# EAGLE schematic Bottom PCB v36 (EAGLE 9.7.0)
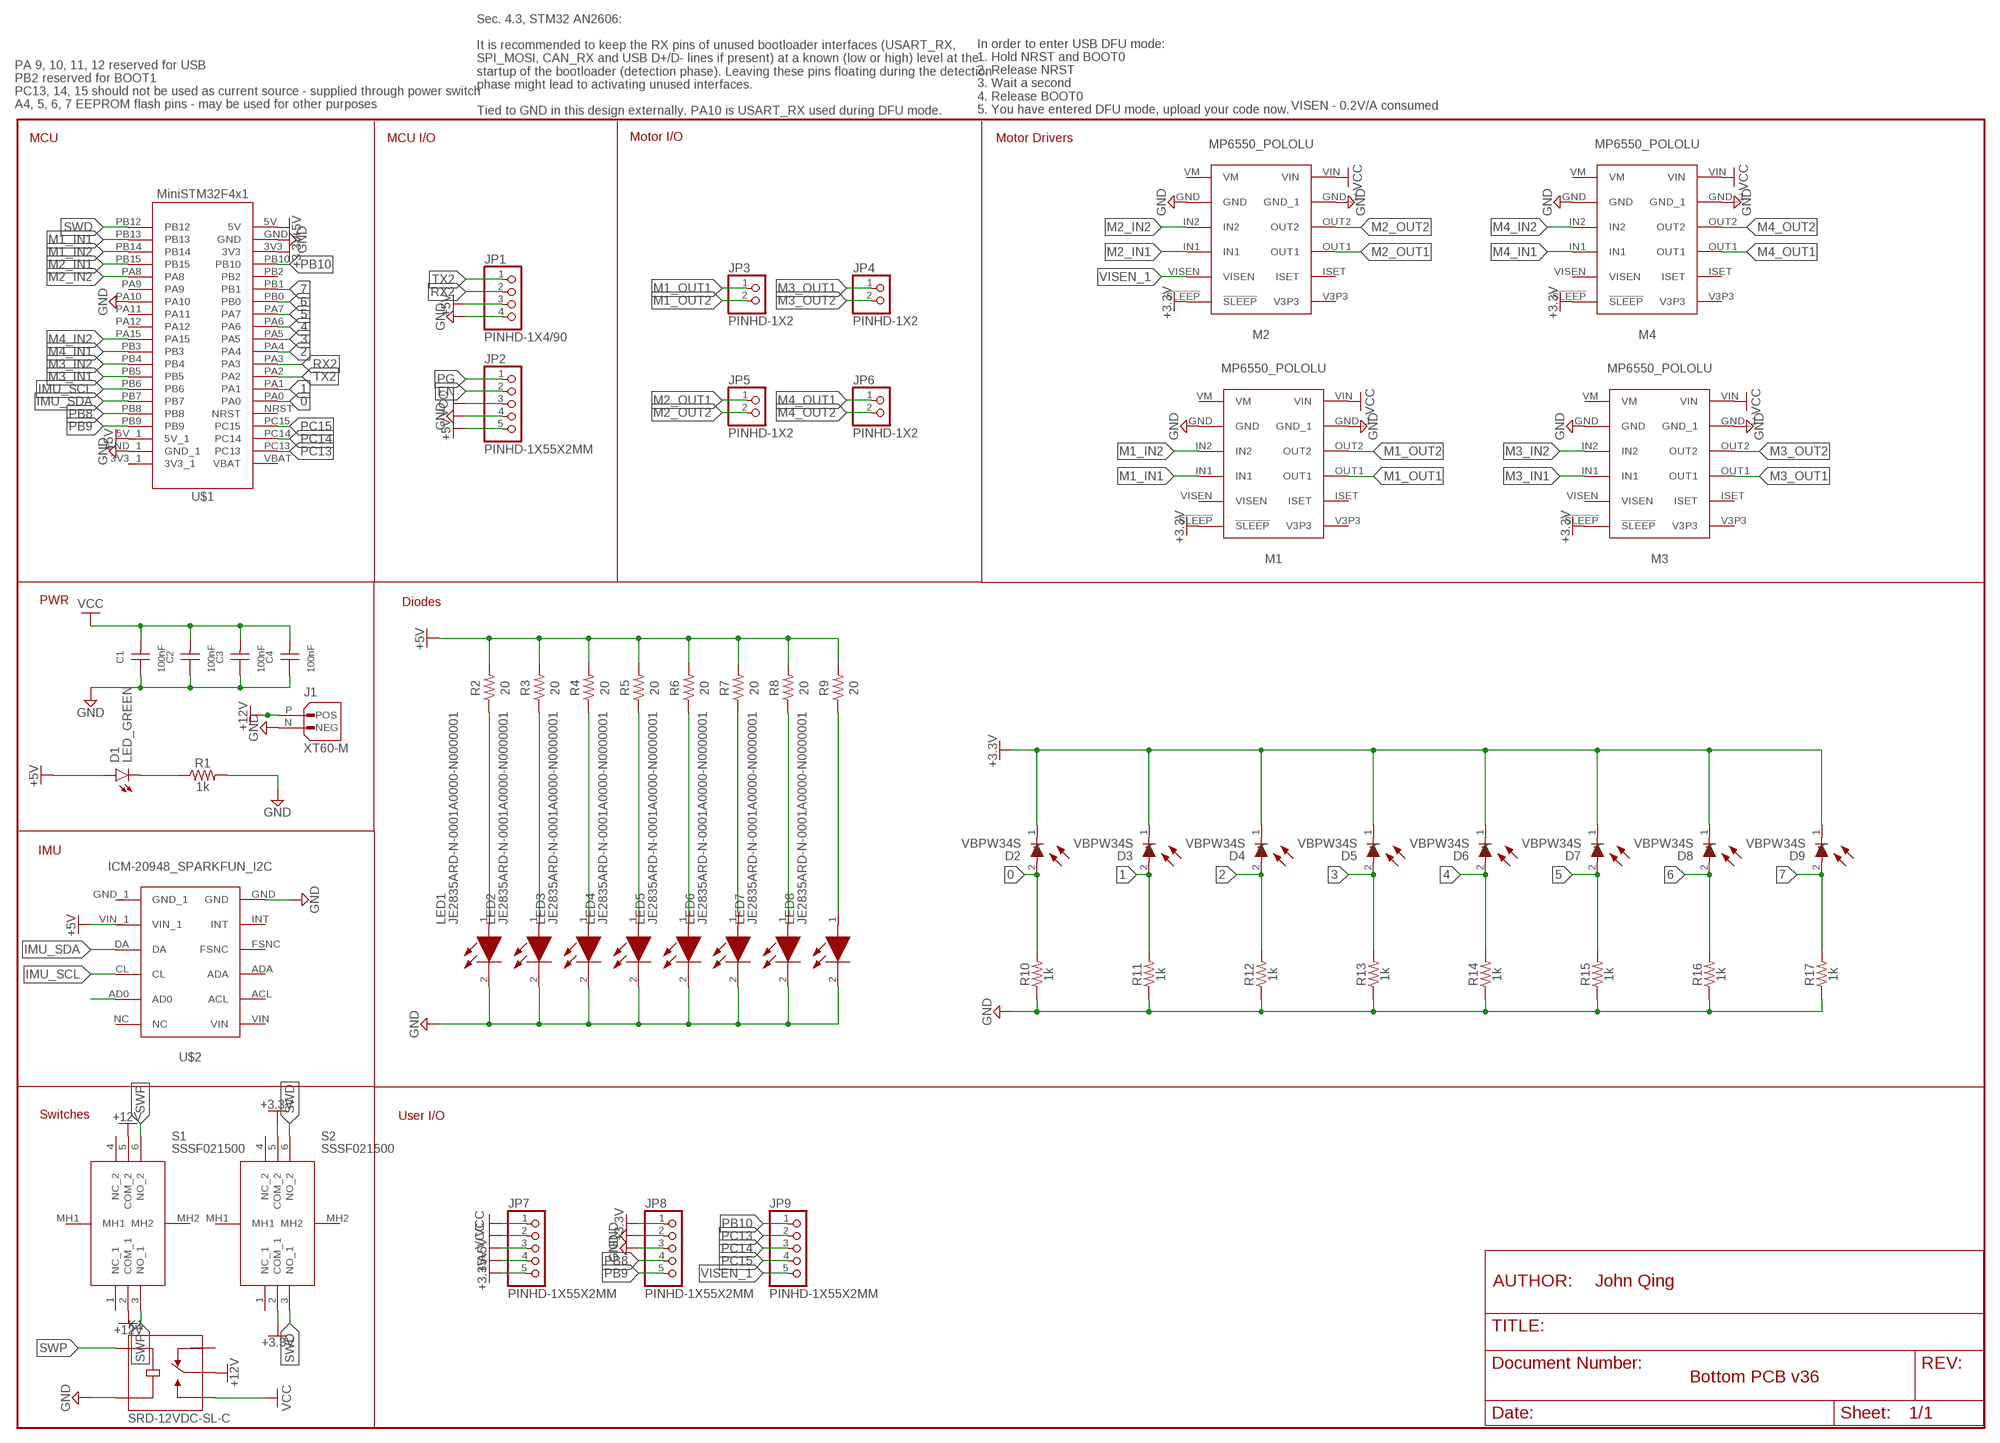
[diagram p0: schematic, sheet 1]

## Parts
C1  100nF  WCAP-CSGP_0603_885012206120_100V(DC)_W  [WCAP-CSGP_0603_W]
C2  100nF  WCAP-CSGP_0603_885012206120_100V(DC)_W  [WCAP-CSGP_0603_W]
C3  100nF  WCAP-CSGP_0603_885012206120_100V(DC)_W  [WCAP-CSGP_0603_W]
C4  100nF  WCAP-CSGP_0603_885012206120_100V(DC)_W  [WCAP-CSGP_0603_W]
D1  LED_GREEN  CHIP-FLAT-G_0402  [LEDC1005X25N_FLAT-G]
D2  VBPW34S  [VBPW34S]
D3  VBPW34S  [VBPW34S]
D4  VBPW34S  [VBPW34S]
D5  VBPW34S  [VBPW34S]
D6  VBPW34S  [VBPW34S]
D7  VBPW34S  [VBPW34S]
D8  VBPW34S  [VBPW34S]
D9  VBPW34S  [VBPW34S]
J1  XT60-M  [AMASS_XT60-M]
JP1  PINHD-1X4/90  [1X04/90]
JP2  PINHD-1X55X2MM  [1_05X2MM]
JP3  PINHD-1X2  [1X02]
JP4  PINHD-1X2  [1X02]
JP5  PINHD-1X2  [1X02]
JP6  PINHD-1X2  [1X02]
JP7  PINHD-1X55X2MM  [1_05X2MM]
JP8  PINHD-1X55X2MM  [1_05X2MM]
JP9  PINHD-1X55X2MM  [1_05X2MM]
K1  SRD-12VDC-SL-C  [RELAY_SRD-12VDC-SL-C]
LED1  JE2835ARD-N-0001A0000-N0000001  [JE2835ARDN0001A0000N0000001]
LED2  JE2835ARD-N-0001A0000-N0000001  [JE2835ARDN0001A0000N0000001]
LED3  JE2835ARD-N-0001A0000-N0000001  [JE2835ARDN0001A0000N0000001]
LED4  JE2835ARD-N-0001A0000-N0000001  [JE2835ARDN0001A0000N0000001]
LED5  JE2835ARD-N-0001A0000-N0000001  [JE2835ARDN0001A0000N0000001]
LED6  JE2835ARD-N-0001A0000-N0000001  [JE2835ARDN0001A0000N0000001]
LED7  JE2835ARD-N-0001A0000-N0000001  [JE2835ARDN0001A0000N0000001]
LED8  JE2835ARD-N-0001A0000-N0000001  [JE2835ARDN0001A0000N0000001]
M1  MP6550_POLOLU  [MP6550_POLOLU]
M2  MP6550_POLOLU  [MP6550_POLOLU]
M3  MP6550_POLOLU  [MP6550_POLOLU]
M4  MP6550_POLOLU  [MP6550_POLOLU]
R1  1k  1KOHM-0603-1/10W-1%  [0603]
R2  20  R-US_CHIP-1210(3225-METRIC)  [RESC3224X71]
R3  20  R-US_CHIP-1210(3225-METRIC)  [RESC3224X71]
R4  20  R-US_CHIP-1210(3225-METRIC)  [RESC3224X71]
R5  20  R-US_CHIP-1210(3225-METRIC)  [RESC3224X71]
R6  20  R-US_CHIP-1210(3225-METRIC)  [RESC3224X71]
R7  20  R-US_CHIP-1210(3225-METRIC)  [RESC3224X71]
R8  20  R-US_CHIP-1210(3225-METRIC)  [RESC3224X71]
R9  20  R-US_CHIP-1210(3225-METRIC)  [RESC3224X71]
R10  1k  1KOHM-0603-1/10W-1%  [0603]
R11  1k  1KOHM-0603-1/10W-1%  [0603]
R12  1k  1KOHM-0603-1/10W-1%  [0603]
R13  1k  1KOHM-0603-1/10W-1%  [0603]
R14  1k  1KOHM-0603-1/10W-1%  [0603]
R15  1k  1KOHM-0603-1/10W-1%  [0603]
R16  1k  1KOHM-0603-1/10W-1%  [0603]
R17  1k  1KOHM-0603-1/10W-1%  [0603]
S1  SSSF021500  [SSSF021500]
S2  SSSF021500  [SSSF021500]
U$1  MINISTM32F4X1  [MINISTM32F4X1]
U$2  ICM-20948_SPARKFUN_I2C  [ICM-20948_SPARKFUN_I2C]

## Nets
0: D2.2(A) R10.2 U$1.PA0
1: D3.2(A) R11.2 U$1.PA1
2: D4.2(A) R12.2 U$1.PA4
3: D5.2(A) R13.2 U$1.PA5
4: D6.2(A) R14.2 U$1.PA6
5: D7.2(A) R15.2 U$1.PA7
6: D8.2(A) R16.2 U$1.PB0
7: D9.2(A) R17.2 U$1.PB1
+3.3V: D2.1(K) D3.1(K) D4.1(K) D5.1(K) D6.1(K) D7.1(K) D8.1(K) D9.1(K) JP7.5 JP8.1 M1.!SLEEP M2.!SLEEP M3.!SLEEP M4.!SLEEP S2.2(COM_1) S2.5(COM_2) U$1.3V3
+5V: D1.A JP1.3 JP2.5 JP7.3 JP7.4 R2.2 R3.2 R4.2 R5.2 R6.2 R7.2 R8.2 R9.2 U$1.5V U$1.5V_1 U$2.VIN_1
+12V: J1.P(POS) K1.COM S1.2(COM_1) S1.5(COM_2)
EN: JP2.2
GND: C1.1 C2.1 C3.1 C4.1 J1.N(NEG) JP1.4 JP2.4 JP8.2 JP8.3 K1.COIL2 LED1.2(K) LED2.2(K) LED3.2(K) LED4.2(K) LED5.2(K) LED6.2(K) LED7.2(K) LED8.2(K) M1.GND M1.GND_1 M2.GND M2.GND_1 M3.GND M3.GND_1 M4.GND M4.GND_1 R1.2 R10.1 R11.1 R12.1 R13.1 R14.1 R15.1 R16.1 R17.1 U$1.GND U$1.GND_1 U$1.PA10 U$2.GND
IMU_SCL: U$1.PB6 U$2.CL
IMU_SDA: U$1.PB7 U$2.DA
M1_IN1: M1.IN1 U$1.PB13
M1_IN2: M1.IN2 U$1.PB14
M1_OUT1: JP3.1 M1.OUT1
M1_OUT2: JP3.2 M1.OUT2
M2_IN1: M2.IN1 U$1.PB15
M2_IN2: M2.IN2 U$1.PA8
M2_OUT1: JP5.1 M2.OUT1
M2_OUT2: JP5.2 M2.OUT2
M3_IN1: M3.IN1 U$1.PB5
M3_IN2: M3.IN2 U$1.PB4
M3_OUT1: JP4.1 M3.OUT1
M3_OUT2: JP4.2 M3.OUT2
M4_IN1: M4.IN1 U$1.PB3
M4_IN2: M4.IN2 U$1.PA15
M4_OUT1: JP6.1 M4.OUT1
M4_OUT2: JP6.2 M4.OUT2
N$1: D1.C R1.1
N$2: LED1.1(A) R2.1
N$3: LED2.1(A) R3.1
N$4: U$2.AD0
N$5: LED3.1(A) R4.1
N$6: LED4.1(A) R5.1
N$7: LED5.1(A) R6.1
N$8: LED6.1(A) R7.1
N$9: LED7.1(A) R8.1
N$10: LED8.1(A) R9.1
PB8: JP8.4 U$1.PB8
PB9: JP8.5 U$1.PB9
PB10: JP9.1 U$1.PB10
PC13: JP9.2 U$1.PC13
PC14: JP9.3 U$1.PC14
PC15: JP9.4 U$1.PC15
PG: JP2.1
RX2: JP1.2 U$1.PA3
SWD: S2.3(NO_1) S2.6(NO_2) U$1.PB12
SWP: K1.COIL1 S1.3(NO_1) S1.6(NO_2)
TX2: JP1.1 U$1.PA2
VCC: C1.2 C2.2 C3.2 C4.2 JP2.3 JP7.1 JP7.2 K1.NO M1.VIN M2.VIN M3.VIN M4.VIN
VISEN_1: JP9.5 M2.VISEN
Unconnected: K1.NC M1.ISET M1.V3P3 M1.VISEN M1.VM M2.ISET M2.V3P3 M2.VM M3.ISET M3.V3P3 M3.VISEN M3.VM M4.ISET M4.V3P3 M4.VISEN M4.VM S1.1(NC_1) S1.4(NC_2) S1.MH1 S1.MH2 S2.1(NC_1) S2.4(NC_2) S2.MH1 S2.MH2 U$1.3V3_1 U$1.NRST U$1.PA9 U$1.PA11 U$1.PA12 U$1.PB2 U$1.VBAT U$2.ACL U$2.ADA U$2.FSNC U$2.GND_1 U$2.INT U$2.NC U$2.VIN

## Notes on the sheet
- PA 9, 10, 11, 12 reserved for USB
  PB2 reserved for BOOT1
  PC13, 14, 15 should not be used as current source - supplied through power switch
  A4, 5, 6, 7 EEPROM flash pins - may be used for other purposes
- VISEN - 0.2V/A consumed
- In order to enter USB DFU mode:
  1. Hold NRST and BOOT0
  2. Release NRST
  3. Wait a second
  4. Release BOOT0
  5. You have entered DFU mode, upload your code now.
- Sec. 4.3, STM32 AN2606:
  
  It is recommended to keep the RX pins of unused bootloader interfaces (USART_RX,
  SPI_MOSI, CAN_RX and USB D+/D- lines if present) at a known (low or high) level at the
  startup of the bootloader (detection phase). Leaving these pins floating during the detection
  phase might lead to activating unused interfaces.
  
  Tied to GND in this design externally. PA10 is USART_RX used during DFU mode.
- MCU | MCU I/O | Motor I/O | Motor Drivers
- PWR
- Diodes
- IMU
- Switches | User I/O
- AUTHOR: | John Qing

## Library data of the parts
C1-C4 = Wurth_Capacitors_WCAP-CSGP:WCAP-CSGP_0603: WCAP-CSGP MLCCs 0603 General Purpose Characteristics General purpose product series High performance ceramic High electrical precision and stability ceramic especially for NP0 Minimal aging especially for NP0 Mounting style: SMT-Chip Ceramic: NP0 (Class I), X5R (Class II), X7R (Class II) Temperature coefficient: ±30 ppm/°C; ±0.54 % for NP0 ±15 % for X5R and X7R Operating temperature: -55 °C up to + 125 °C for NP0 and X7R -55 °C up to + 85 °C for X5R Termination: Cu/Ni/Sn Recommended soldering: Reflow soldering Wave soldering for size 0603 Wave soldering for size 0805 (only valid for the thickness ≤0.85 mm) Applications Temperature compensation (NP0) Coupling Decoupling Bypass Smoothing Filtering Resonant circuit <https://www.we-online.com/catalog/media/o177837v209%20MLCC_GRP_all.jpg> Details see: https://www.we-online.com/catalog/en/pbs/capacitors/multilayer_ceramic_chip_capacitors/mlcc_general_purpose Updated by Ella Wu 2022-06-20 2022(C) Würth Elektronik; CERAMIC-TYPE: X7R Class II; DATASHEET-URL: https://www.we-online.com/redexpert/spec/885012206120?ae; DF: 5%; HEIGHT: 0.8mm; MOUNT: SMT; OPERATING-TEMPERATURE: -55 up to +125 °C; PART-NUMBER: 885012206120; QMIN: -; RISO: 1GOhm; SIZE: 0603; TECHNICAL-REFERENCE: X7R0603104K100DFCT10000; VR: 100V(DC)
D1 = LED:CHIP-FLAT-G; CATEGORY: LED; COLOR: GREEN; DESCRIPTION: CHIP LED FLAT; SUB-CATEGORY: CHIP; TYPE: FLAT_TOP
D2-D9 = VBPW34S:VBPW34S: Photodiode PIN Chip 940nm 2-Pin SMD T/R Source: Datasheet <https://componentsearchengine.com/Datasheets/2/VBPW34S.pdf>; DESCRIPTION: Photodiode PIN Chip 940nm 2-Pin SMD T/R; HEIGHT: 1.4mm; MANUFACTURER_NAME: Vishay; MANUFACTURER_PART_NUMBER: VBPW34S; MOUSER_PART_NUMBER: 782-VBPW34S; MOUSER_PRICE-STOCK: https://www.mouser.co.uk/ProductDetail/Vishay-Semiconductors/VBPW34S?qs=Uj7aA%252BCqp8ZDwjFKEZ8K8A%3D%3D
J1 = XT60-M:XT60-M: Check availability <https://pricing.snapeda.com/parts/XT60-M/AMASS/view-part?ref=eda>; AVAILABILITY: Not in stock; CHECK_PRICES: https://www.snapeda.com/parts/XT60-M/AMASS/view-part/?ref=eda; DESCRIPTION: Plug; DC supply; XT60; male; PIN: 2; for cable; soldered; 30A; 500V; MF: AMASS; MP: XT60-M; PACKAGE: Package; PRICE: None; SNAPEDA_LINK: https://www.snapeda.com/parts/XT60-M/AMASS/view-part/?ref=snap
JP1 = Connector:PINHD-1X4: PIN HEADER; CATEGORY: Headers; DESCRIPTION: Header, Right Angle, 4 Position; MANUFACTURER: Generic; MPN: Generic; OPERATING_TEMPERATURE: Generic; PART_STATUS: Active; PITCH: 0.100" (2.54mm); ROHS_COMPLIANCE: Generic; SERIES: Generic; SUB-CATEGORY: Headers, Male Pins; TYPE: Board to Board or Cable, Unshrouded, Through Hole, Right Angle
JP2 JP7-JP9 = Connector:PINHD-1X5: PIN HEADER; CATEGORY: Headers; DESCRIPTION: Header, Straight, 5 Position; MANUFACTURER: Generic; MPN: Generic; OPERATING_TEMPERATURE: Generic; PART_STATUS: Active; PITCH: 0.079" (2.00mm); ROHS_COMPLIANCE: Generic; SERIES: Generic; SUB-CATEGORY: Headers, Male Pins; TYPE: Board to Board or Cable, Unshrouded, Through Hole, Straight
JP3-JP6 = Connector:PINHD-1X2: PIN HEADER; CATEGORY: Headers; DESCRIPTION: Header, Straight, 2 Position; MANUFACTURER: Generic; MPN: Generic; OPERATING_TEMPERATURE: Generic; PART_STATUS: Active; PITCH: 0.100" (2.54mm); ROHS_COMPLIANCE: Generic; SERIES: Generic; SUB-CATEGORY: Headers, Male Pins; TYPE: Board to Board or Cable, Unshrouded, Through Hole, Straight
K1 = SRD-12VDC-SL-C:SRD-12VDC-SL-C: General Purpose Non Latching 12VDC SPDT Through Hole Relays RoHS Check availability <https://pricing.snapeda.com/parts/SRD-12VDC-SL-C/Songle%20Relay/view-part?ref=eda>; AVAILABILITY: In Stock; CHECK_PRICES: https://www.snapeda.com/parts/SRD-12VDC-SL-C/Songle+Relay/view-part/?ref=eda; DESCRIPTION: General Purpose Non Latching 12VDC SPDT Through Hole Relays RoHS; MF: Songle Relay; MP: SRD-12VDC-SL-C; PACKAGE: NON STANDARD-5 Songle Relay; PRICE: None; SNAPEDA_LINK: https://www.snapeda.com/parts/SRD-12VDC-SL-C/Songle+Relay/view-part/?ref=snap
LED1-LED8 = JE2835ARD-N-0001A0000-N0000001:JE2835ARD-N-0001A0000-N0000001: LED Lighting Color J Red-Orange 615nm (610nm ~ 620nm) 1411 (3528 Metric) Source: Datasheet <https://cree-led.com/media/documents/JSeries-2835-Color_1.pdf>; DESCRIPTION: LED Lighting Color J Red-Orange 615nm (610nm ~ 620nm) 1411 (3528 Metric); HEIGHT: 0.8mm; MANUFACTURER_NAME: CREE LED; MANUFACTURER_PART_NUMBER: JE2835ARD-N-0001A0000-N0000001; MOUSER_PART_NUMBER: 941-JE2835ARDN01AN; MOUSER_PRICE-STOCK: https://www.mouser.co.uk/ProductDetail/Cree-LED/JE2835ARD-N-0001A0000-N0000001?qs=tlsG%2FOw5FFi%2FF9M49gTwyg%3D%3D
M1-M4 = MP6550_POLOLU:MP6550_POLOLU
R1 R10-R17 = SparkFun-Resistors:1KOHM: 1kΩ resistor A resistor is a passive two-terminal electrical component that implements electrical resistance as a circuit element. Resistors act to reduce current flow, and, at the same time, act to lower voltage levels within circuits. - Wikipedia; PROD_ID: RES-07856
R2-R9 = Resistor:R-US: Resistor Fixed - ANSI; CATEGORY: Resistor; SUB-CATEGORY: Fixed
S1 S2 = SSSF021500:SSSF021500: 8.5(H)mm, 2mm-travel Type Large-size general purpose Type Source: Datasheet <https://componentsearchengine.com/Datasheets/1/SSSF021500.pdf>; DESCRIPTION: 8.5(H)mm, 2mm-travel Type Large-size general purpose Type; HEIGHT: 14.5mm; MANUFACTURER_NAME: ALPS Electric; MANUFACTURER_PART_NUMBER: SSSF021500; MOUSER_PART_NUMBER: 688-SSSF021500; MOUSER_PRICE-STOCK: https://www.mouser.co.uk/ProductDetail/Alps-Alpine/SSSF021500?qs=fMKjfF2mFoj202onwSDRyQ%3D%3D
U$1 = MiniSTM32F4x1:MINISTM32F4X1
U$2 = ICM-20948_SPARKFUN:ICM-20948_SPARKFUN_I2C